# EAGLE design BOTTOM_BRD_v.1.0.3 (EAGLE 9.6.2)
NYU Shanghai Swarm Robotics 2020
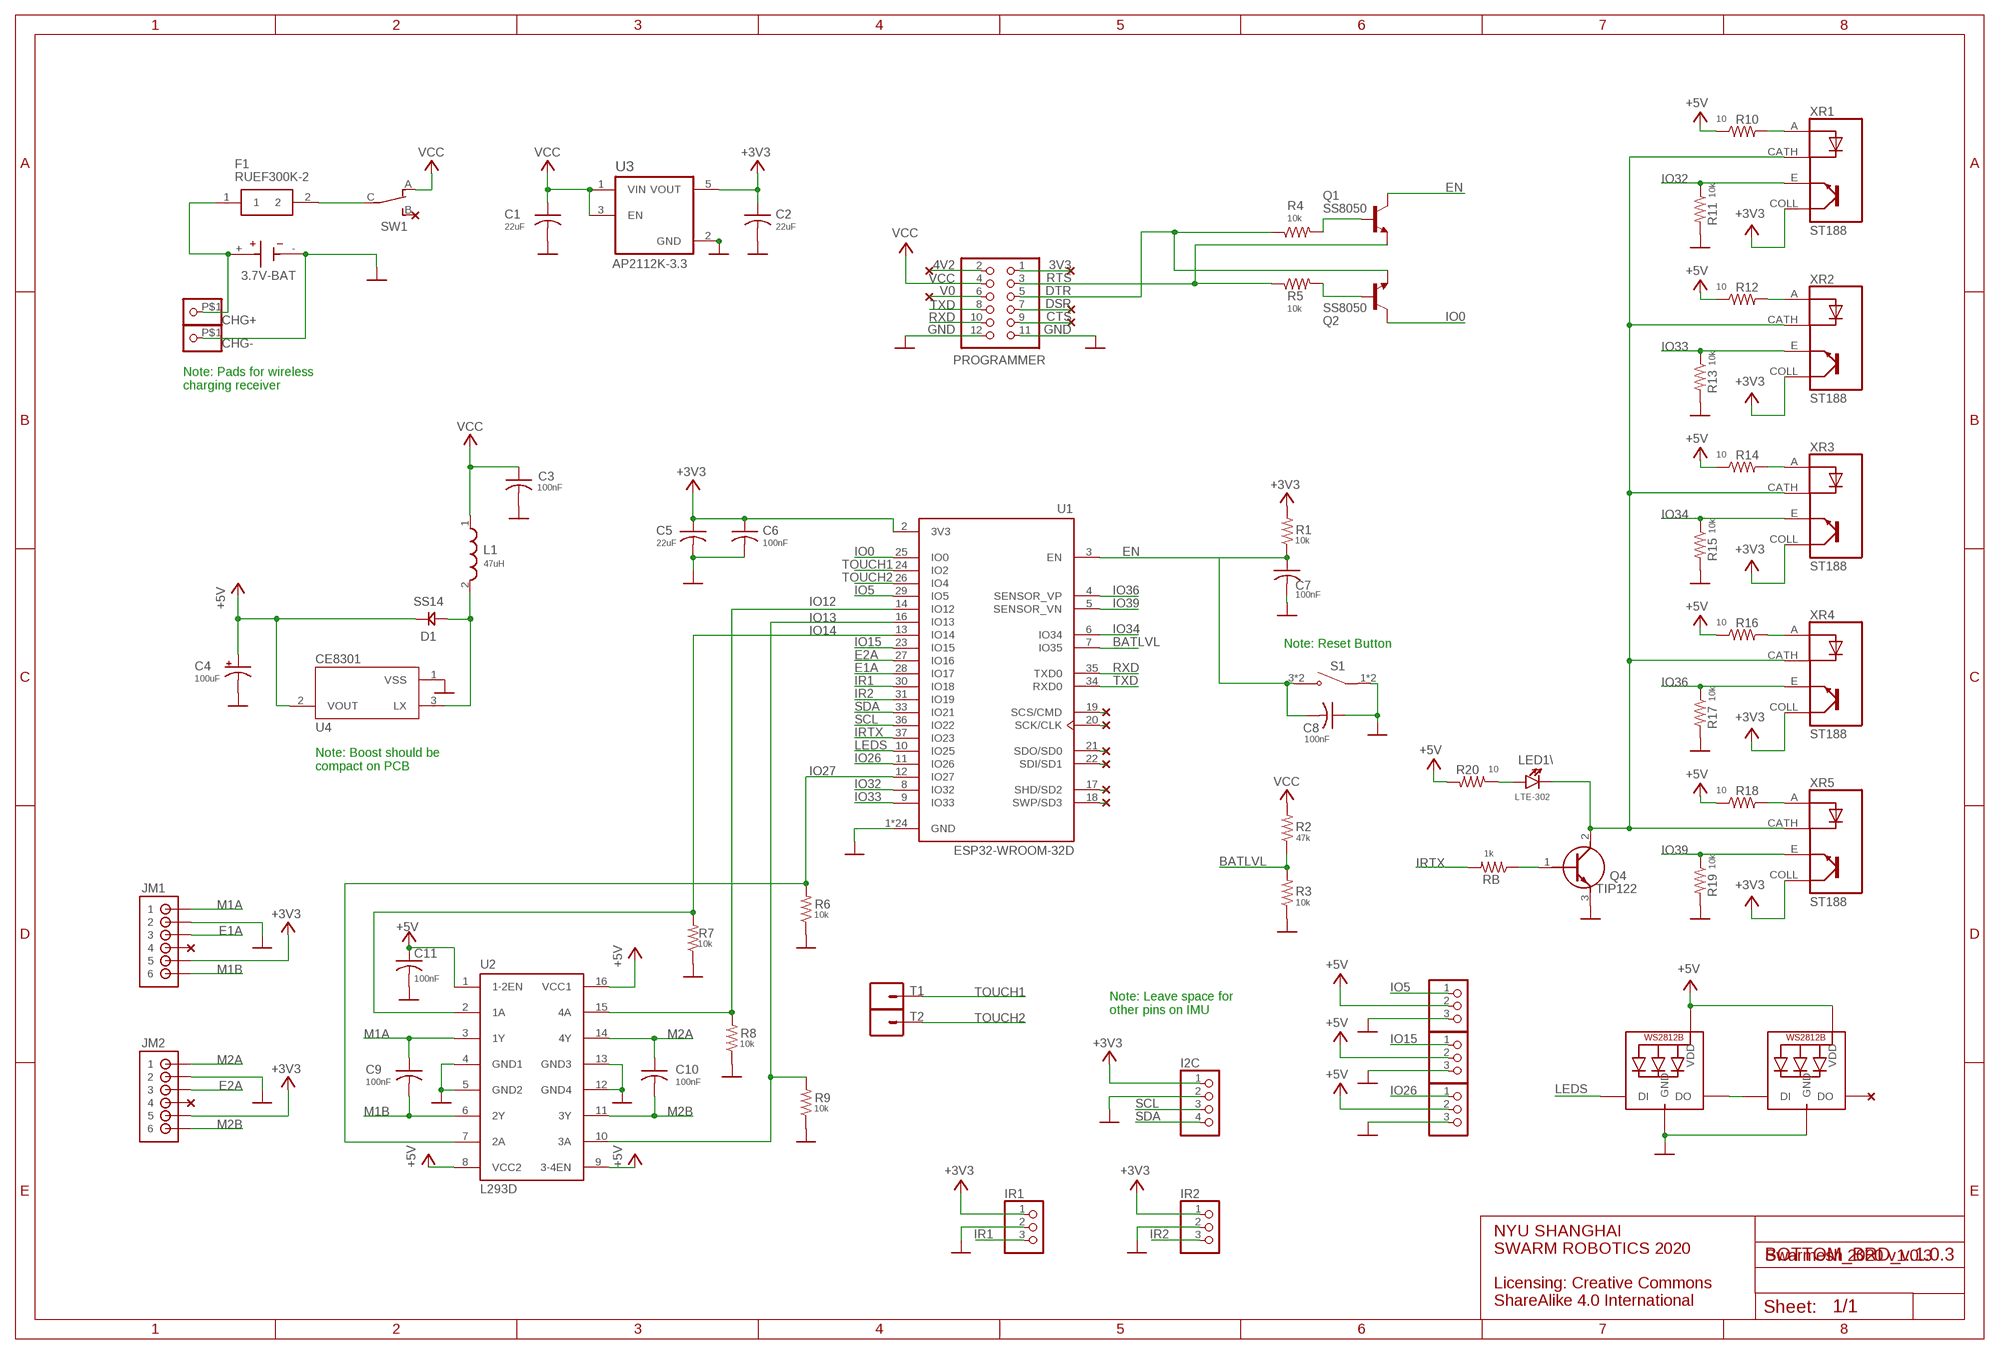
[diagram p0: schematic, sheet 1]

## Parts
BT  3.7V-BAT  6S-AA  [BAT_6S-AA]
C1  22uF  C-USC0805  [C0805]
C2  22uF  C-USC0805  [C0805]
C3  100nF  C-USC0805  [C0805]
C4  100uF  CPOL-US153CLV-0605  [153CLV-0605]
C5  22uF  C-USC0805  [C0805]
C6  100nF  C-USC0805  [C0805]
C7  100nF  C-USC0805  [C0805]
C8  100nF  C-USC0805  [C0805]
C9  100nF  C-USC0805  [C0805]
C10  100nF  C-USC0805  [C0805]
C11  100nF  C-USC0805  [C0805]
CHARGING  WS2812B5050  [WS2812B]
CHG+  PINHD-1X1-BIGPOGO  [1X1-BIGPOGO]
CHG-  PINHD-1X1-BIGPOGO  [1X1-BIGPOGO]
D1  SS14  [DO214]
F1  RUEF300K-2  [RUEF300K2]
GPIO5  PINHD-1X3  [1X03]
GPIO15  PINHD-1X3  [1X03]
GPIO26  PINHD-1X3  [1X03]
I2C  PINHD-1X4  [1X04]
IR1  PINHD-1X3  [1X03]
IR2  PINHD-1X3  [1X03]
JM1  B6B-ZR  [B6B-ZR]
JM2  B6B-ZR  [B6B-ZR]
L1  47uH  SDR0604-100KL  [INDP5858X480N]
LED1\  LTE-302  [LTE-302]
PROGRAMMER  PINHD-2X6  [2X06]
Q1  SS8050  BC850  [SOT23]
Q2  SS8050  BC850  [SOT23]
Q4  TIP122  [TO270P460X1020X2008-3P]
R1  10k  R-US_M0805  [M0805]
R2  47k  R-US_M0805  [M0805]
R3  10k  R-US_M0805  [M0805]
R4  10k  R-US_M0805  [M0805]
R5  10k  R-US_M0805  [M0805]
R6  10k  R-US_M0805  [M0805]
R7  10k  R-US_M0805  [M0805]
R8  10k  R-US_M0805  [M0805]
R9  10k  R-US_M0805  [M0805]
R10  10  R-US_M0805  [M0805]
R11  10k  R-US_M0805  [M0805]
R12  10  R-US_M0805  [M0805]
R13  10k  R-US_M0805  [M0805]
R14  10  R-US_M0805  [M0805]
R15  10k  R-US_M0805  [M0805]
R16  10  R-US_M0805  [M0805]
R17  10k  R-US_M0805  [M0805]
R18  10  R-US_M0805  [M0805]
R19  10k  R-US_M0805  [M0805]
R20  10  R-US_M0805  [M0805]
RB  1k  R-US_M0805  [M0805]
S1  2-1437565-9  [SW_2-1437565-9]
STATE  WS2812B5050  [WS2812B]
SW1  CS12ANW03  [CS12ANW03]
T1  CONN_01SPRING-CONN  [SPRING-CONNECTOR]
T2  CONN_01SPRING-CONN  [SPRING-CONNECTOR]
U1  ESP32-WROOM-32D  [MODULE_ESP32-WROOM-32D]
U2  L293D  [DIL16]
U3  AP2112K-3.3  AP2112K-3.3TRG1  [SOT95P285X140-5N]
U4  CE8301  MCP1702T-3302E/MB  [REG_MCP1702T-3302E/MB]
XR1  ST188  TCRT1000  [XDCR_TCRT1000]
XR2  ST188  TCRT1000  [XDCR_TCRT1000]
XR3  ST188  TCRT1000  [XDCR_TCRT1000]
XR4  ST188  TCRT1000  [XDCR_TCRT1000]
XR5  ST188  TCRT1000  [XDCR_TCRT1000]

## Nets
3V3: PROGRAMMER.1
4V2: PROGRAMMER.2
+3V3: C2.1 C5.1 C6.1 I2C.1 IR1.1 IR2.1 JM1.5 JM2.5 R1.2 U1.2(3V3) U3.5(VOUT) XR1.COLL(CO) XR2.COLL(CO) XR3.COLL(CO) XR4.COLL(CO) XR5.COLL(CO)
+5V: C4.+ C11.1 CHARGING.1-VDD(VDD) D1.CATHODE(KATHODE) GPIO5.2 GPIO15.2 GPIO26.2 R10.1 R12.1 R14.1 R16.1 R18.1 R20.2 STATE.1-VDD(VDD) U2.1(1-2EN) U2.8(VCC2) U2.9(3-4EN) U2.16(VCC1) U4.2(VOUT)
BATLVL: R2.1 R3.2 U1.7(IO35)
CTS: PROGRAMMER.9
DSR: PROGRAMMER.7
DTR: PROGRAMMER.5 Q2.2(E) R4.1
E1A: JM1.3 U1.28(IO17)
E2A: JM2.3 U1.27(IO16)
EN: C7.1 C8.2 Q1.3(C) R1.1 S1.3(NO) S1.4(NO) U1.3(EN)
GND: BT.- C1.2 C2.2 C3.2 C4.- C5.2 C6.2 C7.2 C8.1 C11.2 CHARGING.3-GND(GND) CHG-.P$1 GPIO5.3 GPIO15.3 GPIO26.3 I2C.2 IR1.2 IR2.2 JM1.2 JM2.2 PROGRAMMER.11 PROGRAMMER.12 Q4.3(E) R3.1 R6.1 R7.1 R8.1 R9.1 R11.2 R13.2 R15.2 R17.2 R19.2 S1.1(COM) S1.2(COM) STATE.3-GND(GND) U1.1(GND) U1.15(GND) U1.38(GND) U1.39_1(GND) U1.39_2(GND) U1.39_3(GND) U1.39_4(GND) U1.39_5(GND) U1.39_6(GND) U1.39_7(GND) U1.39_8(GND) U1.39_9(GND) U1.39_10(GND) U1.39_11(GND) U1.39_12(GND) U1.39_13(GND) U1.39_14(GND) U1.39_15(GND) U1.39_16(GND) U1.39_17(GND) U1.39_18(GND) U1.39_19(GND) U1.39_20(GND) U1.39_21(GND) U2.4(GND1) U2.5(GND2) U2.12(GND4) U2.13(GND3) U3.2(GND) U4.1(VSS)
IO0: Q2.3(C) U1.25(IO0)
IO5: GPIO5.1 U1.29(IO5)
IO12: R8.2 U1.14(IO12) U2.15(4A)
IO13: R9.2 U1.16(IO13) U2.10(3A)
IO14: R7.2 U1.13(IO14) U2.2(1A)
IO15: GPIO15.1 U1.23(IO15)
IO26: GPIO26.1 U1.11(IO26)
IO27: R6.2 U1.12(IO27) U2.7(2A)
IO32: R11.1 U1.8(IO32) XR1.E
IO33: R13.1 U1.9(IO33) XR2.E
IO34: R15.1 U1.6(IO34) XR3.E
IO36: R17.1 U1.4(SENSOR_VP) XR4.E
IO39: R19.1 U1.5(SENSOR_VN) XR5.E
IR1: IR1.3 U1.30(IO18)
IR2: IR2.3 U1.31(IO19)
IRTX: RB.2 U1.37(IO23)
LEDS: CHARGING.4-DIN(DI) U1.10(IO25)
M1A: C9.1 JM1.1 U2.3(1Y)
M1B: C9.2 JM1.6 U2.6(2Y)
M2A: C10.1 JM2.1 U2.14(4Y)
M2B: C10.2 JM2.6 U2.11(3Y)
N$1: BT.+ CHG+.P$1 F1.1
N$2: Q4.1(B) RB.1
N$3: F1.2 SW1.C
N$4: D1.ANODE L1.2 U4.3(LX)
N$5: U1.19(SCS/CMD)
N$6: R12.2 XR2.A
N$7: R16.2 XR4.A
N$8: LED1\.C Q4.2(C) XR1.CATH(C) XR2.CATH(C) XR3.CATH(C) XR4.CATH(C) XR5.CATH(C)
N$9: CHARGING.2-DOUT(DO) STATE.4-DIN(DI)
N$10: R14.2 XR3.A
N$11: R18.2 XR5.A
N$12: Q1.1(B) R4.2
N$13: R10.2 XR1.A
N$14: LED1\.A R20.1
N$15: Q2.1(B) R5.2
N$16: U1.20(SCK/CLK)
N$18: U1.21(SDO/SD0)
N$23: U1.22(SDI/SD1)
N$24: U1.17(SHD/SD2)
N$25: U1.18(SWP/SD3)
RTS: PROGRAMMER.3 Q1.2(E) R5.1
RXD: PROGRAMMER.10 U1.35(TXD0)
SCL: I2C.3 U1.36(IO22)
SDA: I2C.4 U1.33(IO21)
TOUCH1: T1.P$2 U1.24(IO2)
TOUCH2: T2.P$2 U1.26(IO4)
TXD: PROGRAMMER.8 U1.34(RXD0)
V0: PROGRAMMER.6
VCC: C1.1 C3.1 L1.1 PROGRAMMER.4 R2.2 SW1.A U3.1(VIN) U3.3(EN)
Unconnected: JM1.4 JM2.4 STATE.2-DOUT(DO) SW1.B

## Notes on the sheet
- Note: Pads for wireless 
  charging receiver
- Note: Reset Button
- Note: Boost should be
  compact on PCB
- Note: Leave space for 
  other pins on IMU
- Swarmesh 2020 v1.0.3
- NYU SHANGHAI
  SWARM ROBOTICS 2020
  
  Licensing: Creative Commons
  ShareAlike 4.0 International

## Library data of the parts
BT = 6S-AA:6S-AA; AVAILABILITY: Unavailable; DESCRIPTION: BATTERY HOLDER AA PC PIN; DIGIKEY-PURCHASE-URL: https://snapeda.com/shop?store=DigiKey&id=4389101; MF: MPD; MP: 6S-AA; PACKAGE: None; PRICE: None
C1-C3 C5-C11 = rcl:C-US: CAPACITOR, American symbol; SPICEPREFIX: C
C4 = rcl:CPOL-US: POLARIZED CAPACITOR, American symbol; SPICEPREFIX: C
CHARGING STATE = adafruit:WS2812B
CHG+ CHG- = adafruit:PINHD-1X1: Pin header 1x1 for 0.1" spacing With round pins
D1 = SS14:SS14; AVAILABILITY: Unavailable; DESCRIPTION: Diode Schottky 40V 1A Surface Mount SMA (DO-214AC); DIGIKEY-PURCHASE-URL: https://snapeda.com/shop?store=DigiKey&id=229686; MF: ON Semiconductor; MP: SS14; PACKAGE: DO-214AC-214 ON Semiconductor; PRICE: None
F1 = RUEF300K-2:RUEF300K-2: TE CONNECTIVITY / RAYCHEM - RUEF300K-2 - RESETTABLE FUSE, PTC, 30V, 3A, RADIAL Source: Datasheet <http://www.farnell.com/datasheets/1482689.pdf>; DESCRIPTION: TE CONNECTIVITY / RAYCHEM - RUEF300K-2 - RESETTABLE FUSE, PTC, 30V, 3A, RADIAL; HEIGHT: 16.5mm; MANUFACTURER_NAME: TE CONNECTIVITY / RAYCHEM; MANUFACTURER_PART_NUMBER: RUEF300K-2
GPIO5 GPIO15 GPIO26 IR1 IR2 = adafruit:PINHD-1X3: PIN HEADER
I2C = pinhead:PINHD-1X4: PIN HEADER
JM1 JM2 = B6B-ZR:B6B-ZR: JST-ZH Connector 6 pol, 1.5mm pitch Package: B6B-ZR Source: http://www.jst-mfg.com/product/pdf/eng/eZH.pdf; AVAILABILITY: Unavailable; DESCRIPTION: Connector Header Surface Mount 6 position 0.059 _1.50mm_; MF: JST; MP: B6B-ZR; PACKAGE: None; PRICE: None
L1 = SDR0604-100KL:SDR0604-100KL: Inductor Power Wirewound 120uH 10% 1KHz 22Q-Factor Ferrite 480mA 930mOhm DCR T/R; AVAILABILITY: Unavailable; DESCRIPTION: 10µH Unshielded Wirewound Inductor Nonstandard; MF: Bourns; MP: SDR0604-100KL; PACKAGE: Nonstandard Bourns; PRICE: None
LED1\ = LTE-302:LTE-302: Through-hole side-firing 940nm IR LED; DESCRIPTION: Infrared (IR) Emitter 940nm 1.2V 50mA 0.662mW/sr @ 20mA 40° Radial, Side View; DIGI-KEY_PART_NUMBER: 160-1930-ND; MF: Lite-On Inc.; MP: LTE-302; PACKAGE: Radial Lite-On
PROGRAMMER = pinhead:PINHD-2X6: PIN HEADER
Q1 Q2 = transistor:BC850: NPN TRANSISTOR
Q4 = TIP122:TIP122: TIP122, Darlington Transistor, NPN 8 A 100 V HFE:1000, 3-Pin, TO-220 Source: Datasheet <https://componentsearchengine.com/Datasheets/1/TIP122.pdf>; DESCRIPTION: TIP122, Darlington Transistor, NPN 8 A 100 V HFE:1000, 3-Pin, TO-220; HEIGHT: 4.6mm; MANUFACTURER_NAME: STMicroelectronics; MANUFACTURER_PART_NUMBER: TIP122; MOUSER_PART_NUMBER: 511-TIP122; MOUSER_PRICE-STOCK: https://www.mouser.com/Search/Refine.aspx?Keyword=511-TIP122
R1-R20 RB = rcl:R-US_: RESISTOR, American symbol; SPICEPREFIX: R
S1 = pushswitch:2-1437565-9; AVAILABILITY: Unavailable; COMMENT: 2-1437565-9; DESCRIPTION: Tactile Switch SPST-NO Top Actuated Surface Mount; MF: TE Connectivity; MP: 2-1437565-9; PACKAGE: SMD-6 Omron Electronics; PRICE: None
SW1 = SWITCH_C:CS12ANW03; AVAILABILITY: Unavailable; DESCRIPTION: Slide Switch SPDT Through Hole; DIGIKEY-PURCHASE-URL: https://snapeda.com/shop?store=DigiKey&id=478299; MF: NKK Switches; MP: CS12ANW03; PACKAGE: None; PRICE: None
T1 T2 = Touch_Pad:CONN_01: Single connection point. Often used as Generic Header-pin footprint for 0.1 inch spaced/style header connections On any of the 0.1 inch spaced packages, you can populate with these: Break Away Headers - Straight <https://www.sparkfun.com/products/116> (PRT-00116) Break Away Male Headers - Right Angle <https://www.sparkfun.com/products/553> (PRT-00553) Female Headers <https://www.sparkfun.com/products/115> (PRT-00115) Break Away Headers - Machine Pin <https://www.sparkfun.com/products/117> (PRT-00117) Break Away Female Headers - Swiss Machine Pin <https://www.sparkfun.com/products/743> (PRT-00743) This device is also useful as a general connection point to wire up your design to another part of your project. Our various solder wires solder well into these plated through hole pads. Hook-Up Wire - Assortment (Stranded, 22 AWG) <https://www.sparkfun.com/products/11375> (PRT-11375) Hook-Up Wire - Assortment (Solid Core, 22 AWG) <https://www.sparkfun.com/products/11367> (PRT-11367) View the entire wire category on our website here <https://www.sparkfun.com/categories/141> Special notes: SMTSO-256-ET is a "flush mount" nut for a 4-40 screw. We mostly use this on specialty testbeds; it is a nice way to connect hardware to your PCB at an adjustable hieght. Also note, the SNAP packages are for using a snappable style connector. We sell a baggie of snaps and they are also used on two LilyPad designs: Snap Assortment - 30 pack (male and female) <https://www.sparkfun.com/products/11347> (DEV-11347) LilyPad Arduino SimpleSnap <https://www.sparkfun.com/products/10941> (DEV-10941) LilyPad SimpleSnap Protoboard <https://www.sparkfun.com/products/10940> (DEV-10940); SF_ID: PRT-11822
U1 = ESP32-WROOM-32D:ESP32-WROOM-32D: Bluetooth, WiFi 802.11b/g/n, Bluetooth v4.2 + EDR, Class 1, 2 and 3 Transceiver Module 2.4GHz ~ 2.5GHz Integrated, Trace Surface Mount; AVAILABILITY: Unavailable; DESCRIPTION: Bluetooth, WiFi 802.11b/g/n, Bluetooth v4.2 +EDR, Class 1, 2 and 3 Transceiver Module 2.4GHz ~ 2.5GHz Integrated, Trace Surface Mount; MF: Espressif Systems; MP: ESP32-WROOM-32D; PACKAGE: Module Espressif Systems; PRICE: None
U2 = st-microelectronics:L293D: PUSH-PULL 4 CHANNEL DRIVER; MPN: L293D; OC_FARNELL: 9589619; OC_NEWARK: 56P8249
U3 = AP2112K-3.3TRG1:AP2112K-3.3TRG1: AP2112 Series 0.6 A 3.3 V Fixed Output SMT LDO Linear Regulator - SOT23-5; AVAILABILITY: Unavailable; DESCRIPTION: Linear Voltage Regulator IC 1 Output 600mA SOT-25; MF: Diodes Inc.; MP: AP2112K-3.3TRG1; PACKAGE: SOT-753 Diodes Inc.; PRICE: None
U4 = MCP1702T-3302E_MB:MCP1702T-3302E/MB: MCP1702 Series 250 mA 3.3 V Fixed Output Surface Mount LDO Regulator - SOT-89; AVAILABILITY: Unavailable; DESCRIPTION: Linear Voltage Regulator IC 1 Output 250mA SOT-89-3; MF: Microchip; MP: MCP1702T-3302E/MB; PACKAGE: SOT-89 Microchip; PRICE: None
XR1-XR5 = ST188:TCRT1000: Optical Sensor The TCRT1000 and TCRT1010 are reflective sensors which include an infrared emitter and phototransistor in a leaded package which blocks visible light; AVAILABILITY: Unavailable; DESCRIPTION: Reflective Optical Sensor 0.157 (4mm) PCB Mount; MF: Vishay; MP: TCRT1000; PACKAGE: PCB Mount Vishay; PRICE: None

## Board
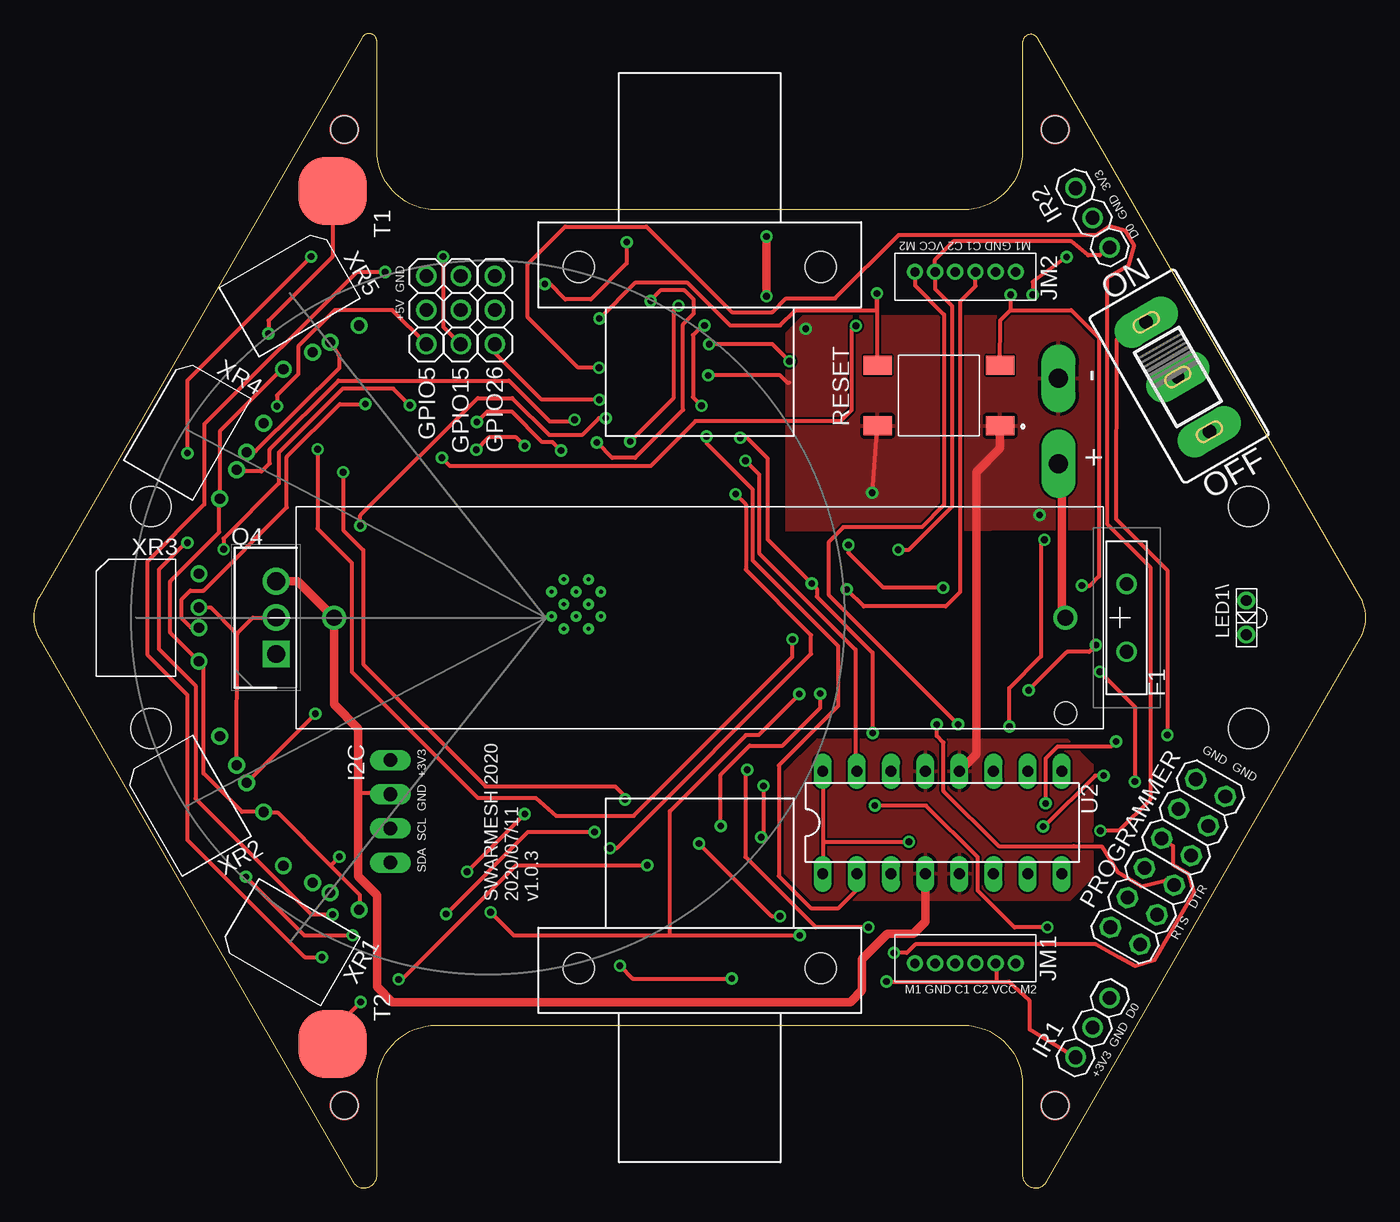
[diagram p1: board, top side]
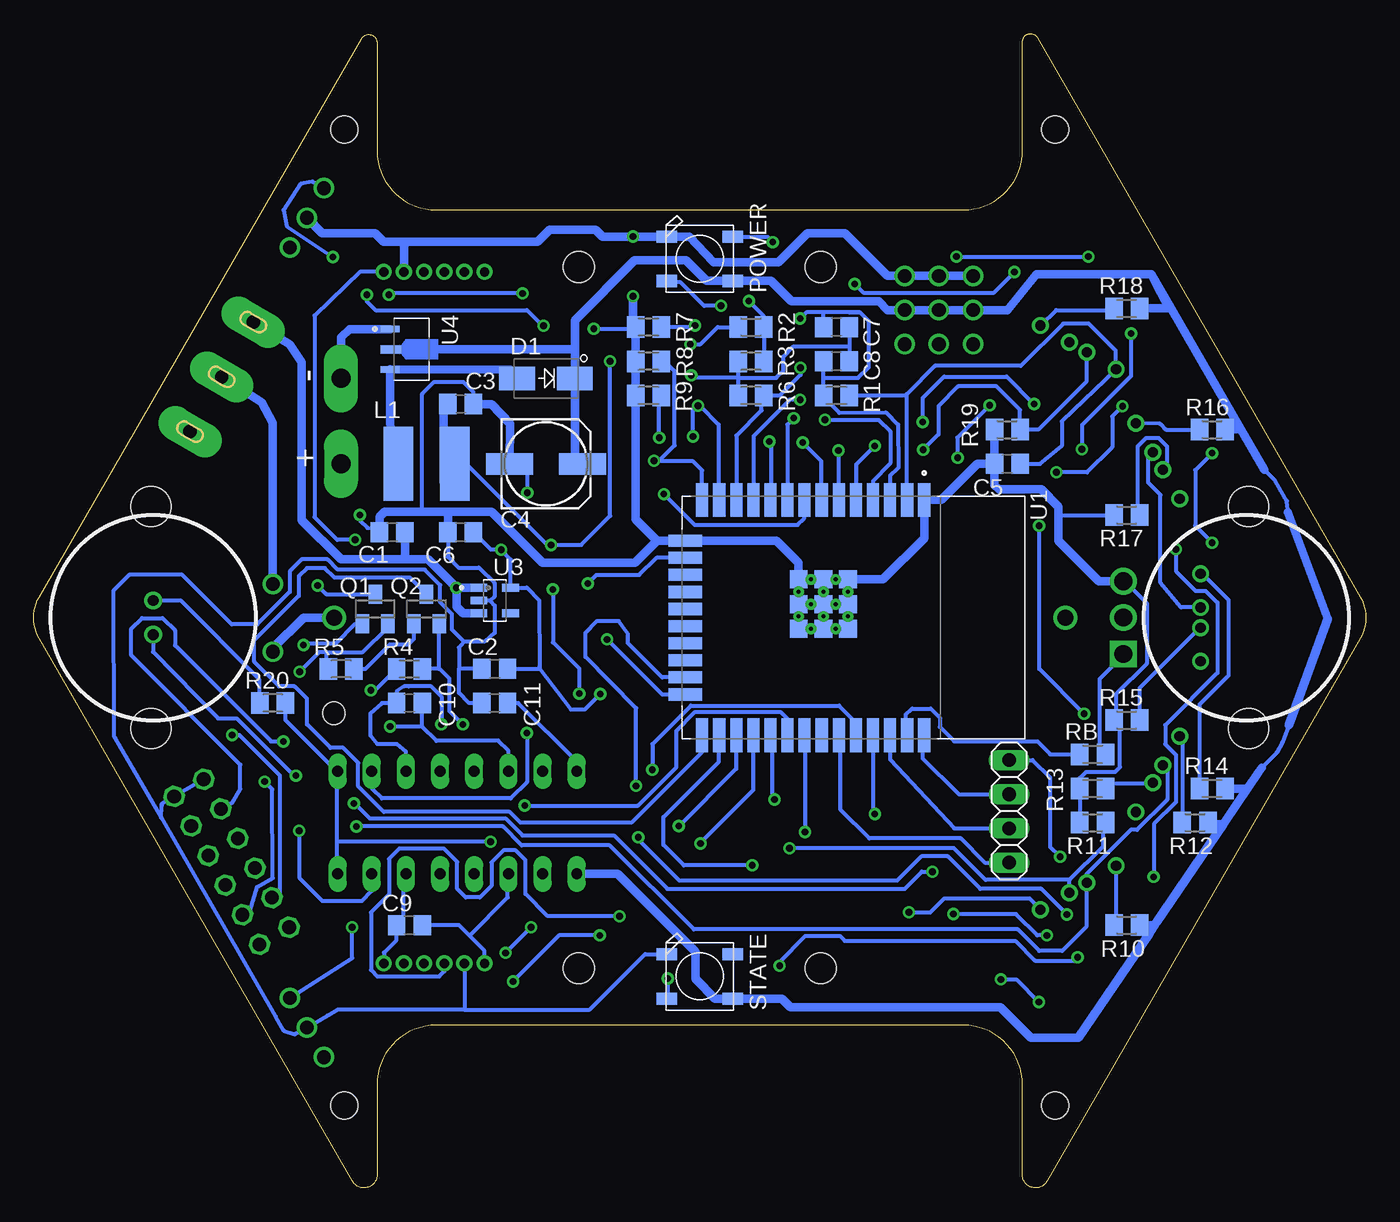
[diagram p2: board, bottom side, seen from below]

Size 99.06 x 85.8 mm. Coordinates in mm from the lower left corner, seen from the top.
Outline: 75.33,0.48 98.65,40.87 arc60 98.65,43.91 74.68,85.43 arc150 73.53,85.12 73.53,77.1 arc-90 69.12,72.69 29.94,72.69 arc-90 25.53,77.1 25.53,85.2 arc150 24.42,85.5 0.41,43.91 arc60 0.41,40.87 23.73,0.48 arc150 25.53,0.97 25.53,7.68 arc-90 29.94,12.09 69.12,12.09 arc-90 73.53,7.68 73.53,0.97 arc150 75.33,0.48
Copper layers (1*16): Top 0.035mm / dielectric 0.15mm / Bottom 0.035mm
Design rules "default *": minimum track width 12mil, minimum drill 0.5mm, track to track 6mil, track to pad 6mil, pad to pad 6mil, via to via 20mil, smd to smd 6mil, copper to edge 40mil, drill to drill 25mil, minimum pad ring 10mil, minimum via ring 8mil, stop-mask expansion 4mil, vias tented up to drill 0mil, thermal gap 10mil
Holes 2 mm at 75.96,78.66 23.11,78.66 23.11,6.12 75.96,6.12
Holes 3 mm at 8.73,50.64 8.73,34.14 90.33,50.64 90.33,34.14
Holes 2.3 mm at 58.53,16.33 40.53,16.33 40.53,68.45 58.53,68.45
tKeepout: area 74.3,77 to 77.6,80.3; area 21.5,77 to 24.7,80.3; area 21.5,4.5 to 24.7,7.7; area 74.3,4.5 to 77.6,7.7
tRestrict: area 30.8,33.4 to 49.8,51.3

### Footprints (pad centres in the part's own frame; a part is rotated, then mirrored left to right if it is on the bottom)
BAT_6S-AA = drill 1.19: + -27.2,0; - 27.2,0 | hole 1.67: -27.2,7.1
C0805 = smd 1.3 x 1.5: 1 -0.95,0; 2 0.95,0
153CLV-0605 = smd 3.5 x 1.6: + 2.7,0; - -2.7,0
WS2812B = smd 1.5 x 0.9: 1-VDD 2.45,-1.65; 2-DOUT 2.45,1.65; 3-GND -2.45,1.65; 4-DIN -2.45,-1.65
1X1-BIGPOGO = drill 1.4 pad 2.54 long: P$1 0,0
DO214 = smd 2.65 x 1.75: ANODE -2.15,0; CATHODE 2.15,0
RUEF300K2 = drill 1.01 pad 1.515: 1 0,0; 2 5.05,0
1X03 = drill 1.016: 1 -2.54,0; 2 0,0; 3 2.54,0
1X04 = drill 1.016 long: 1 -3.81,0; 2 -1.27,0; 3 1.27,0; 4 3.81,0
B6B-ZR = drill 0.7: 1 9,-1.3; 2 7.5,-1.3; 3 6,-1.3; 4 4.5,-1.3; 5 3,-1.3; 6 1.5,-1.3
INDP5858X480N = smd 2.2 x 5.5: 1 -2.1,0; 2 2.1,0
LTE-302 = drill 0.8: A 1.27,0; C -1.27,0
2X06 = drill 1.016 octagon: 1 -6.35,-1.27; 2 -6.35,1.27; 3 -3.81,-1.27; 4 -3.81,1.27; 5 -1.27,-1.27; 6 -1.27,1.27; 7 1.27,-1.27; 8 1.27,1.27; 9 3.81,-1.27; 10 3.81,1.27; 11 6.35,-1.27; 12 6.35,1.27
SOT23 = smd 1 x 1.4: 1 -0.95,-1.1; 2 0.95,-1.1; 3 0,1.1
TO270P460X1020X2008-3P = drill 1.32 pad 1.98 square: 1 0,0 | drill 1.32 pad 1.98: 2 2.7,0; 3 5.4,0
M0805 = smd 1.3 x 1.6: 1 -0.95,0; 2 0.95,0
SW_2-1437565-9 = smd 2.1 x 1.4: 1 -4.55,2.25; 2 4.55,2.25; 3 -4.55,-2.25; 4 4.55,-2.25
CS12ANW03 = drill 1 pad 2.54 long: A -4.674,0; B 4.724,0; C 0.025,0
SPRING-CONNECTOR = smd 5.08 x 5.08: P$2 0,0
MODULE_ESP32-WROOM-32D = smd 2.5 x 0.9: 1 -8.75,5.26; 2 -8.75,3.99; 3 -8.75,2.72; 4 -8.75,1.45; 5 -8.75,0.18; 6 -8.75,-1.09; 7 -8.75,-2.36; 8 -8.75,-3.63; 9 -8.75,-4.9; 10 -8.75,-6.17; 11 -8.75,-7.44; 12 -8.75,-8.71; 13 -8.75,-9.98; 14 -8.75,-11.25; 25 8.75,-11.25; 26 8.75,-9.98; 27 8.75,-8.71; 28 8.75,-7.44; 29 8.75,-6.17; 30 8.75,-4.9; 31 8.75,-3.63; 32 8.75,-2.36; 33 8.75,-1.09; 34 8.75,0.18; 35 8.75,1.45; 36 8.75,2.72; 37 8.75,3.99; 38 8.75,5.26 | smd 0.9 x 2.5: 15 -5.715,-12.5; 16 -4.445,-12.5; 17 -3.175,-12.5; 18 -1.905,-12.5; 19 -0.635,-12.5; 20 0.635,-12.5; 21 1.905,-12.5; 22 3.175,-12.5; 23 4.445,-12.5; 24 5.715,-12.5 | smd 1.33 x 1.33: 39_1 -2.835,-0.405; 39_2 -1,-0.405; 39_3 0.835,-0.405; 39_4 -2.835,-2.24; 39_5 -1,-2.24; 39_6 0.835,-2.24; 39_7 -2.835,-4.075; 39_8 -1,-4.075; 39_9 0.835,-4.075 | drill 0.3 pad 0.4: 39_10 -1.917,-0.405; 39_11 -0.083,-0.405; 39_12 -2.835,-1.323; 39_13 -1,-1.323; 39_14 0.835,-1.323; 39_15 -1.917,-2.24; 39_16 -0.083,-2.24; 39_17 -2.835,-3.158; 39_18 -1,-3.158; 39_19 0.835,-3.158; 39_20 -1.917,-4.075; 39_21 -0.083,-4.075
DIL16 = drill 0.813 long: 1 -8.89,-3.81; 2 -6.35,-3.81; 3 -3.81,-3.81; 4 -1.27,-3.81; 5 1.27,-3.81; 6 3.81,-3.81; 7 6.35,-3.81; 8 8.89,-3.81; 9 8.89,3.81; 10 6.35,3.81; 11 3.81,3.81; 12 1.27,3.81; 13 -1.27,3.81; 14 -3.81,3.81; 15 -6.35,3.81; 16 -8.89,3.81
SOT95P285X140-5N = smd 1.35 x 0.6: 1 -1.185,0.95; 2 -1.185,0; 3 -1.185,-0.95; 4 1.185,-0.95; 5 1.185,0.95
REG_MCP1702T-3302E/MB = smd 1.4 x 0.48: 1 -1.425,1.5; 3 -1.425,-1.5 | smd 1.525 x 0.56: 2 -1.365,0
XDCR_TCRT1000 = drill 0.75 pad 1.1: A -3.25,4.67; CATH -0.75,4.67; COLL 3.25,4.67; E 0.75,4.67

### Placement (x,y rotation side)
BT  49.53,42.39 180 top
C1  72.39,48.74 180 bottom
C2  64.77,38.58 180 bottom
C3  67.31,58.27 0 bottom
C4  60.96,53.82 0 bottom
C5  26.67,53.82 180 bottom
C6  67.31,48.74 180 bottom
C7  39.37,63.98 0 bottom
C8  39.37,61.44 180 bottom
C9  71.12,19.53 180 bottom
C10  71.12,36.04 180 bottom
C11  64.77,36.04 180 bottom
CHARGING  49.53,69.06 0 bottom
CHG+  76.2,53.82 270 bottom
CHG-  76.2,60.17 90 top
D1  60.96,60.17 0 bottom
F1  81.28,39.85 90 top
GPIO5  29.21,65.25 90 top
GPIO15  31.75,65.25 90 top
GPIO26  34.29,65.25 90 top
I2C  26.53,27.99 270 bottom
IR1  78.74,11.91 60 top
IR2  78.74,72.11 120 top
JM1  74.53,15.39 180 top
JM2  64.03,69.39 0 top
L1  69.85,53.82 180 bottom
LED1\  90.17,42.39 90 top
PROGRAMMER  84.34,24.24 60 top
Q1  73.66,43.03 0 bottom
Q2  69.85,43.03 0 bottom
Q4  18.03,39.69 90 top
R1  39.37,58.9 0 bottom
R2  45.72,63.98 180 bottom
R3  45.72,61.44 0 bottom
R4  71.12,38.58 180 bottom
R5  76.2,38.58 0 bottom
R6  45.72,58.9 0 bottom
R7  53.34,63.98 0 bottom
R8  53.34,61.44 0 bottom
R9  53.34,58.9 0 bottom
R10  17.78,19.53 180 bottom
R11  20.32,27.15 180 bottom
R12  12.7,27.15 180 bottom
R13  20.32,29.69 180 bottom
R14  11.43,29.69 180 bottom
R15  17.78,34.77 180 bottom
R16  11.43,56.36 180 bottom
R17  17.78,50.01 180 bottom
R18  17.78,65.38 180 bottom
R19  26.67,56.36 180 bottom
R20  81.28,36.04 0 bottom
RB  20.32,32.23 180 bottom
S1  67.31,58.9 180 top
STATE  49.53,15.72 0 bottom
SW1  85.06,60.3 300 top
T1  22.23,74.09 0 top
T2  22.23,10.69 0 top
U1  38.1,42.39 270 bottom
U2  67.56,27.15 0 top
U3  64.77,43.66 0 bottom
U4  71.12,62.33 0 bottom
XR1  19.05,18.26 330 top
XR2  11.43,28.42 300 top
XR3  7.62,42.39 270 top
XR4  11.43,56.36 240 top
XR5  19.05,66.52 210 top

### Tracks (layer width: path | path; a pad name or v marks a point on that pad's centre or on a via)
+3V3  (via drill 0.5)
  Top 0.305: XR5.COLL 18.41,60.81 13.84,56.23 XR4.COLL 13.81,51.12 13.81,48.74 10.16,45.09 10.16,41.27 XR3.COLL 12.64,38.83 12.64,30.8 15.49,27.95 16.99,27.95 XR2.COLL 17.11,27.91 18.13,27.91 22.08,23.96 | 71.6,15.34 71.6,16.67 JM1.5 | XR1.COLL 24.26,20.74 24.26,21.79 22.08,23.96 | 22.08,23.96 v22.73,24.61 | v63.4,15.34 71.6,15.34 | 47.31,18.77 35.69,18.77 v33.97,20.48 | 47.31,18.77 v56.96,18.77 | v56.93,36.71 53.88,33.66 52.96,33.66 47.31,28.01 47.31,18.77 | IR1.1 74.05,11.78 74.04,13.94 72.52,15.34 71.6,15.34 | IR2.1 80.01,69.88 79.25,69.32 78.41,69.32 77.17,70.36 68.39,70.36 67.03,69 JM2.5 67.03,66.82 68.29,65.56 68.29,50.65 65.09,47.44 v64.29,47.44
  Bottom 0.305: 62.37,44.61 U3.5 63.58,46.7 64.34,47.46 v64.29,47.44 65.06,47.44 C6.1 | 62.37,44.61 | 63.54,38.3 C2.1 61.55,38.58 61.46,38.58 | R1.2 34.23,58.9 34.13,59 | 34.13,51.28 U1.2 34.13,59 | 34.13,59 32.04,61.09 25.65,61.09 22.51,64.24 20.61,64.24 18.61,62.24 18.61,60.88 XR5.COLL 22.61,56.98 22.61,55.15 24.23,53.82 C5.1 | I2C.1 24.78,31.8 23.49,30.52 23.49,25.37 v22.73,24.61 | v63.4,15.34 63.44,15.34 60.01,18.77 v56.96,18.77 | v33.97,20.48 32.38,20.48 31.37,21.5 24.99,21.5 24.2,20.71 XR1.COLL | v56.93,36.71 58.07,35.57 59.11,35.57 61.42,38.58 61.46,38.58 | 62.37,44.61 61.47,43.66 61.46,38.71 61.46,38.58
+5V  (via drill 0.5)
  Top 0.305: 58.74,25.72 58.74,23.34 U2.1 | 58.74,25.72 58.74,30.96 U2.16 | 58.74,25.72 v65.09,25.72
  Bottom 0.305: 5.71,34.39 6.23,33.1 6.63,32.36 7.75,31.24 | 7.56,53.38 6.78,52.61 5.86,51.04 5.81,50.41 | 5.8,50.27 5.81,50.41 | 5.8,50.24 5.81,50.41 | 76.52,30.96 80.33,34.77 R20.2 | 76.52,30.96 76.52,25.72 | 76.52,25.72 76.52,23.34 U2.8 | 76.52,30.96 U2.9 | C11.1 63.02,36.04 58.74,31.76 58.74,30.96 U2.16 | 3.02,42.39 2.97,42.37 2.82,42.32 | R12.1 | 9.05,29.53 8.95,29.47 | R10.1 16.35,19.06 16.12,18.9 | v65.09,25.72 76.52,25.72 | 14.69,65.38 14.6,65.25 14.45,65.34
  Bottom 0.635: U2.1 55.63,23.34 49.85,17.56 49.85,15.53 48.39,14.07 STATE.1-VDD 43.94,14.07 43.43,14.07 42.8,13.44 27.18,13.44 24.89,11.15 21.37,11.15 16.12,18.9 15.73,19.48 15.53,19.77 | 7.75,31.24 7.96,30.93 | 7.96,30.93 8.82,29.66 10.45,29.66 R14.1 | 7.96,30.93 8.81,29.67 | 8.81,29.67 10.53,27.14 | 8.81,29.67 8.95,29.47 10.61,27.03 | 10.61,27.03 15.53,19.77 | 5.8,50.24 2.82,42.32 4.94,36.5 5.71,34.39 | 58.26,53.57 C4.+ 58.79,54.35 D1.CATHODE 58.81,62.33 | 15.94,67.92 24.49,67.92 26.67,65.25 GPIO5.2 GPIO15.2 GPIO26.2 35.56,65.25 36.19,65.89 41.75,65.89 42.72,65.89 44.25,67.41 CHARGING.1-VDD 49.02,67.41 50.54,68.93 54.36,68.93 58.81,64.49 58.81,62.46 58.81,62.33 | 14.65,65.43 15.24,66.52 15.94,67.92 | 15.94,67.92 | U4.2 58.81,62.33 | 7.56,53.38 9.3,56.4 | 9.3,56.4 14.45,65.34 15.94,67.92 | R16.1 9.3,56.4 | 14.69,65.38 R18.1 | R10.1 15.76,19.53 15.53,19.77 | R12.1 11.63,27.03 10.61,27.03
BATLVL  (via drill 0.5)
  Top 0.305: v45.88,65.92 45.88,65.98 46.61,66.71 48.39,66.71 49.08,66.01 49.08,65 48.29,64.2 48.29,57.82 44.74,54.27 43.02,54.27 v41.88,55.41
  Bottom 0.305: R3.2 R2.1 44.8,63.98 44.8,64.84 v45.88,65.92 | v41.88,55.41 40.48,54.01 40.48,51.28 U1.7
DTR  (via drill 0.5)
  Top 0.305: v67.15,34.45 67.15,33.6 67.66,33.09 67.66,29.5 71.75,25.41 77.34,25.41 79.42,25.39 80.62,23.46 82.35,22.42 84.22,22.87 PROGRAMMER.5
  Bottom 0.305: Q2.2 68.93,41.92 68.93,38.58 R4.1 68.87,38.58 68.13,37.85 68.13,35.44 v67.15,34.45
E1A  (via drill 0.5)
  Top 0.305: v49.47,25.6 54.86,20.2 v55.5,20.2
  Bottom 0.305: JM1.3 68.53,16.09 68.9,15.72 73.5,15.72 73.98,16.2 73.98,20.48 72.64,21.82 72.64,24.45 71.88,25.21 68.55,25.21 67.56,24.23 67.56,22.23 66.93,21.6 65.88,21.6 65.02,22.45 65.02,24.2 64.13,25.09 63.21,25.09 62.48,24.36 62.48,21.85 60.83,20.2 v55.5,20.2 | v49.47,25.6 49.47,25.66 45.56,29.56 45.56,33.5 U1.28
E2A  (via drill 0.5)
  Top 0.305: v60.45,44.49 61.72,43.22 67.82,43.22 68.9,44.3 68.9,65.89 70.03,67.02 JM2.3 | v58.48,36.74 58.48,35.66 55.69,32.87 53.24,32.87 51.09,30.71 v51.09,26.9
  Bottom 0.305: v60.45,44.49 60.45,40.55 58.48,38.58 v58.48,36.74 | v51.09,26.9 46.83,31.15 46.83,33.5 U1.27
EN  (via drill 0.5)
  Top 0.305: 72.64,65.25 77.15,65.25 79.22,63.19 79.22,45.46 78.53,44.77 v77.95,44.77 | 71.75,61.28 S1.3 71.88,64.49 72.64,65.25 | v42.07,64.62 44.77,67.32 48.58,67.32 51.78,64.11 55.5,64.11 56.64,65.25 62.71,65.25 v62.71,66.49 62.71,61.21 S1.4 | v72.64,66.39 72.64,65.25
  Bottom 0.305: 73.66,44.46 Q1.3 77.3,44.13 v77.95,44.77 | R1.1 40.32,58.77 39.15,57.6 35.7,57.64 34.79,56.73 34.75,53.54 35.38,52.92 U1.3 | R1.1 40.32,60.2 | 40.32,60.2 C8.2 | 40.57,64.24 C7.1 40.32,65.02 40.26,65.08 | 38.48,65.09 37.61,65.08 | 40.32,60.2 37.75,60.2 36.96,61 36.96,64.43 37.61,65.08 | R1.1 | v72.64,66.39 72.52,66.52 63.05,66.52 63.09,66.49 v62.71,66.49 | 37.61,65.08 40.26,65.08 | 40.26,65.08 41.6,65.08 v42.07,64.62
GND  (via drill 0.5)
  Top 0.305: v50.16,60.39 55.5,60.39 56.04,59.85 56.17,59.85 | 24.13,29.37 26.51,29.37 I2C.2 | v62.36,51.66 S1.2 | U2.5 68.73,24.1 68.76,24.1
  Top 0.635: Q4.3 19.63,45.09 BT.- 22.33,35.94 24.13,34.14 24.13,29.37 24.13,23.16 25.54,21.75 25.54,14.94 26.67,13.82 60.72,13.82 61.59,14.69 61.59,16.99 63.5,18.9 65.4,18.9 66.29,19.79 U2.4 | U2.12 70.1,32.23 70.1,53.21 71.86,54.96 S1.1 | v54.48,66.27 v54.48,70.71
  Bottom 0.305: PROGRAMMER.12 88.45,29.19 | 88.45,29.19 PROGRAMMER.11 | 67.06,13.26 57.71,13.26 53.59,17.37 STATE.3-GND | JM1.2 67.03,13.28 67.06,13.26 | 67.06,13.26 76.45,13.26 77.22,12.8 IR1.2 79.63,11.41 80.46,11.69 81.05,12.73 | 81.05,12.73 89.58,27.53 | 89.58,27.53 89.53,28.42 89.53,28.55 88.45,29.19 | 81.05,12.73 | 65.85,38.45 C2.2 67.44,38.58 | C11.2 66.67,36.04 67.44,36.8 67.44,38.58 | U3.2 65.15,43.66 65.12,43.63 | 65.12,43.63 64.77,43.28 64.77,41.25 65.53,40.61 67.06,40.61 | 67.44,38.58 67.44,40.16 67.06,40.61 | U1.39_5 40.48,43.5 41.12,43.5 U1.39_18 41.27,43.34 42.07,43.34 U1.39_8 | U1.39_8 42.23,43.5 42.23,44.3 U1.39_20 42.23,44.46 42.23,44.93 U1.39_7 41.91,45.25 41.27,45.25 U1.39_17 41.12,45.25 40.48,45.25 U1.39_4 40.32,45.09 40.32,44.46 U1.39_15 | U1.39_8 42.07,43.19 42.07,42.55 U1.39_21 42.23,42.39 42.23,41.6 U1.39_9 42.07,41.6 41.27,41.6 U1.39_19 41.12,41.6 40.48,41.6 U1.39_6 | 68.32,48.68 C6.2 68.26,46.9 67.47,46.11 65.94,46.11 64.8,44.96 64.8,43.95 65.12,43.63 | 54.48,64.62 54.29,64.46 54.29,64.14 R7.1 54.61,63.98 54.61,63.85 | U1.38 32.96,33.52 32.96,31.95 30.26,29.25 26.54,29.25 I2C.2 | 38.42,62.55 C7.2 | 38.42,62.55 C8.1 | 46.67,60.2 R3.1 | 46.67,60.2 R6.1 | 38.42,62.55 42.54,62.55 43.31,61.79 43.31,60.74 43.85,60.2 46.67,60.2 | 18.45,34.74 18.29,34.58 18.29,31.28 18.64,30.93 20.8,30.93 21.27,30.45 R13.2 | 18.45,34.74 18.57,34.87 18.57,36.68 16.29,38.96 16.29,43.44 17.78,44.93 Q4.3 | R13.2 R11.2 | R13.2 | 38.58,41.6 38.58,42.39 U1.39_11 38.58,42.55 38.58,43.34 | 38.58,41.6 39.37,41.6 U1.39_14 39.53,41.6 40.32,41.6 U1.39_6 | 38.58,41.6 U1.39_3 | U1.39_16 40.48,42.39 40.48,41.76 U1.39_6
  Bottom 0.305: 38.58,43.34 39.37,43.34 U1.39_13 | U1.39_12 39.37,45.25 38.73,45.25 U1.39_1 38.58,44.93 38.58,44.46 U1.39_10 38.58,44.3 38.58,43.5 U1.39_2 38.58,43.34 | 22.86,50.01 R17.2 | 18.57,34.77 R15.2 18.41,34.77 18.45,34.74 | v50.16,60.39 49.97,60.2 46.67,60.2 | C3.2 66.36,59.16 67.12,59.92 69.28,59.92 70.17,59.03 70.17,50.27 | v62.36,51.66 62.36,53.69 C4.- | v57.4,63.85 54.61,63.85 | 54.61,63.85 54.36,63.85 | R8.1 54.33,61.59 54.29,61.59 | GPIO15.3 31.7,67.77 31.7,67.79 | C1.2 73.63,49.04 74.23,49.06 74.8,49.63 v74.8,50.01 | 67.06,40.61 67.94,41.5 67.94,42.65 68.83,43.53 68.83,44.8 69.98,45.95 76.45,45.95 77.22,46.71 79.12,46.71 80.01,45.82 80.01,44.3 82.42,41.88 84.33,41.88 88.01,45.57 91.95,45.57 93.09,44.42 93.07,33.58 92.99,33.43 89.58,27.53 | 67.94,49.12 67.94,48.96
  Bottom 0.635: C5.2 28.89,53.82 31.57,51.14 U1.1 32.84,48.29 35.9,45.23 U1.39_1 | Q4.3 19.84,45.09 22.86,48.11 22.86,50.01 22.86,50.65 24.13,51.92 27.3,51.92 27.62,52.23 C5.2 | IR2.2 77.6,70.97 73.66,70.97 73.02,70.33 71.3,70.33 | JM2.2 71.53,70.11 71.3,70.33 | 71.3,70.33 61.59,70.33 60.71,71.22 57.28,71.22 56.77,70.71 v54.48,70.71 CHARGING.3-GND | CHARGING.3-GND 52.07,70.62 | 54.61,61.44 R8.1 | 52.7,48.11 U1.15 43.81,48.11 42.17,46.47 U1.39_7 | 52.7,48.11 54.29,49.69 R9.1 R8.1 | 52.7,48.11 52.7,48.1 54.35,46.46 61.21,46.46 65.02,50.27 68.26,50.27 | C5.2 R19.2 | GPIO5.3 31.7,67.79 GPIO15.3 GPIO26.3 35.56,67.79 38.74,70.97 41.53,70.97 43.69,68.81 48.51,68.81 50.29,70.71 CHARGING.3-GND | 67.94,49.12 68.26,49.12 | 68.26,50.27 70.17,50.27 72.96,50.27 73.34,49.88 C1.2 | R8.1 54.29,61.59 R7.1 | v54.48,66.27 54.48,64.62 | C3.2 65.01,58.27 63.63,56.78 C4.- | U4.1 75.58,63.83 76.2,63.25 CHG-.P$1 | C6.2 68.26,49.12 | 68.26,49.12 68.26,50.27
  pour Top: 57.26,64.74 76.96,64.74 78.74,62.97 78.74,48.99 56.04,48.87 56.04,63.52
  pour Top: 76.86,33.35 78.74,31.47 78.74,23.09 77.03,21.38 57.84,21.38 55.88,23.34 55.88,30.96 58.27,33.35
IO0
  Bottom 0.305: Q2.3 71.1,45.38 76.71,45.38 77.41,46.07 78.74,46.07 79.34,45.47 79.34,44.01 82.64,40.71 82.64,39.12 80.8,37.28 79.66,37.28 78.74,36.36 78.74,34.45 76.99,32.71 76.04,32.71 74.93,31.6 74.93,29.85 73.02,27.95 63.66,27.95 62.86,27.15 54.61,27.15 49.37,32.39 49.37,33.5 U1.25
IO5  (via drill 0.5)
  Top 0.305: v43.97,28.87 43.97,29.12 43.24,29.85 33.59,29.85 24.51,38.93 24.51,47.41 23.02,48.9 v23.02,53.19 | v18.1,58.11 18.1,58.9 19.68,60.49 19.68,62.55 22.38,65.25 26.67,65.25 GPIO5.1
  Bottom 0.305: v43.97,28.87 44.13,29.02 44.13,33.5 U1.29 | v18.1,58.11 18.86,57.35 18.86,55.06 20.73,53.19 v23.02,53.19
IO12  (via drill 0.5)
  Top 0.305: v52.93,54.04 53.94,53.03 53.94,47.19 61.12,40.01 61.12,30.96 U2.15
  Bottom 0.305: R8.2 52.13,61.44 51.4,60.71 51.4,55.19 52.55,54.04 v52.93,54.04 50.07,54.04 49.35,53.32 U1.14
IO13  (via drill 0.5)
  Top 0.305: v52.55,55.76 53.05,55.76 54.58,54.23 54.58,48.2 v57.85,44.93 58.23,44.55 58.23,43.95 62.39,39.79 v62.39,33.82
  Bottom 0.305: v52.55,55.76 52.55,58.9 R9.2 | U1.16 52.76,46.84 54.03,45.57 57.21,45.57 v57.85,44.93 | U2.10 73.91,29.72 73.15,28.96 63.59,28.96 62.39,30.17 v62.39,33.82
IO14  (via drill 0.5)
  Top 0.305: v49.88,64.11 49.75,64.11 49.02,63.38 49.02,58.77 v49.66,58.14 | U2.2 61.21,22.17 59.85,20.8 57.78,20.8 55.4,23.18 55.4,31.41 59.82,35.82 59.82,40.3 53.47,46.65 53.47,51.92 50.04,55.35 v50.04,55.85
  Bottom 0.305: R7.2 49.88,63.98 v49.88,64.11 | U1.13 48.08,51.17 48.13,51.22 48.13,56.74 49.53,58.14 v49.66,58.14 50.04,57.76 v50.04,55.85
IO15  (via drill 0.5)
  Top 0.305: v54.26,29.88 54.26,26.23 v54.1,26.07 | v22.22,20.33 20.64,20.33 12.03,28.93 12.03,37.34 9.3,40.07 9.3,45.95 11.3,47.95 v11.43,47.95 | v11.43,54.62 11.43,60.01 v20.64,69.22 | v30.45,69.22 30.45,64.01 GPIO15.1
  Bottom 0.305: v54.26,29.88 54.26,35.66 58.04,39.46 58.04,41.25 57.15,42.14 55.57,42.14 54.87,41.18 54.87,40.49 52.32,37.95 U1.23 | v54.1,26.07 54.1,25.91 51.02,22.83 34.86,22.83 33.05,24.64 31.08,24.64 28.67,22.23 24.13,22.23 v22.22,20.33 | v11.43,47.95 12.7,49.22 12.7,53.35 v11.43,54.62 | v30.45,69.22 v20.64,69.22
IO26  (via drill 0.5)
  Top 0.305: GPIO26.1 34.29,62.07 37.52,58.83 37.77,58.58 v42.07,58.58
  Bottom 0.305: U1.11 45.53,55.89 42.83,58.58 v42.07,58.58
IO27  (via drill 0.5)
  Top 0.305: v79.31,26.55 80.71,26.55 83.03,28.87 83.03,46.14 79.85,49.31 79.85,67.66 81.43,68.58 81.84,70.02 81.16,71.13 79.99,71.46 79.06,70.84 64.33,70.84 59.59,66.11 55.94,66.11 54.93,65.09 51.91,65.09 45.56,71.44 39.53,71.44 36.73,68.65 36.73,64.71 40.48,60.97 v42.04,60.97
  Bottom 0.305: 44.93,58.58 44.93,57.79 46.8,55.92 46.8,51.15 U1.12 | 44.93,58.58 44.93,58.9 R6.2 | U2.7 73.91,22.07 74.64,21.34 77.6,21.34 79.31,23.06 v79.31,26.55 | 44.93,58.58 R6.2 | R6.2 43.56,58.9 42.04,60.43 v42.04,60.97
IO32  (via drill 0.5)
  Top 0.305: v52.2,51.57 52.96,50.81 52.96,45.95 57.82,41.09 57.82,39.69 43.37,25.25 v42.86,25.25
  Bottom 0.305: 22.03,22.9 19.53,25.41 19.53,27.15 R11.1 | 22.03,22.06 22.03,22.9 | 22.03,22.06 XR1.E | 22.03,22.06 | v52.2,51.57 49.91,49.28 42.26,49.28 41.75,49.79 41.75,51.12 U1.8 | v42.86,25.25 30.64,25.25 28.29,22.9 22.03,22.9
IO33  (via drill 0.5)
  Top 0.305: v42.54,57.22 42.04,57.22 40.77,55.95 38.35,55.95 35.59,58.71 33.02,58.71 24.29,49.98 v24.29,49.22 | v20.95,35.25 15.87,30.17 XR2.E
  Bottom 0.305: R13.1 18.99,30.07 15.86,30.07 XR2.E | v42.54,57.22 43.02,56.74 43.02,51.28 U1.9 | v24.29,49.22 24.29,38.58 v20.95,35.25
IO34  (via drill 0.5)
  Top 0.305: v39.21,54.81 38.58,55.44 37.81,55.44 35.56,57.69 33.72,57.69 v32.96,56.93 | v24.67,58.27 22.76,58.27 18.83,54.33 18.83,50.58 12.64,44.39 11.65,44.39 11.02,43.76 11.02,42.33 11.7,41.64 XR3.E
  Bottom 0.305: R15.1 16.83,37.15 12.38,41.6 XR3.E | v39.21,54.81 39.21,51.28 U1.6 | v32.96,56.93 32.96,58.71 31.37,60.3 26.7,60.3 v24.67,58.27
IO36  (via drill 0.5)
  Top 0.305: v40.23,57.09 40.1,56.96 38.39,56.96 35.34,60.01 22.67,60.01 17.56,54.9 17.56,53.85 16.95,53.25 15.23,53.25 XR4.E
  Bottom 0.305: R17.1 16.99,50.01 16.99,55.09 16.35,55.73 15.4,55.73 14.76,55.09 14.76,53.82 15.08,53.5 XR4.E | v40.23,57.09 36.23,57.09 35.37,56.23 35.37,53.85 36.65,52.54 U1.4
IO39  (via drill 0.5)
  Top 0.305: v36.51,55.16 35.88,55.79 33.85,55.79 v32.92,54.87
  Bottom 0.305: XR5.E 20.8,62.08 20.8,59.92 24.35,56.36 R19.1 25.72,57.82 27.46,59.57 30.32,59.57 31.78,58.11 31.78,56.01 v32.92,54.87 | v36.51,55.16 37.91,53.76 U1.5
IR1  (via drill 0.5)
  Top 0.305: v62.55,28.42 66.36,28.42 70.2,24.58 70.2,22.1 72.93,19.37 v75.37,19.37
  Bottom 0.305: v62.55,28.42 54.13,28.42 51.28,31.28 51.28,33.98 49.88,35.37 43.53,35.37 43.02,34.87 43.02,33.66 U1.30 | IR1.3 75.37,17.08 v75.37,19.37
IR2  (via drill 0.5)
  Top 0.305: v41.71,26.46 36.77,26.46 v30.67,20.36 | v23.72,18.77 20.13,18.77 v15.78,23.12 | v14.13,47.47 14.13,48.27 18.22,52.36 18.22,54.65 22.99,59.41 26.73,59.41 v27.97,58.17 | v30.35,54.27 v30.35,54.26 30.96,53.66 45.87,53.66 49.21,57 60.01,57 60.83,57.82 60.83,63.75 v61.15,64.08 | v74.28,66.39 74.29,67.35 v76.8,69.19
  Bottom 0.305: v41.71,26.46 v41.72,26.47 U1.31 | v30.67,20.36 26.02,20.36 24.43,18.77 v23.72,18.77 | v14.13,47.47 14.13,45.84 12.67,44.39 11.92,44.39 11.04,43.5 11.04,38.28 14.92,34.4 14.92,32.98 14.13,32.19 14.13,28.68 15.75,27.06 15.75,23.15 v15.78,23.12 | v30.35,54.27 30.38,54.23 30.38,55.76 v27.97,58.17 | v61.15,64.08 61.2,64.08 62.38,65.25 73.65,65.25 74.28,65.89 v74.28,66.39 | 77.47,74.3 IR2.3 78.33,74.8 79.2,74.62 80.48,72.67 80.23,71.49 v76.8,69.19
IRTX
  Bottom 0.305: RB.2 23.46,32.23 24.42,33.18 30.61,33.18 31.69,34.26 31.69,34.96 32.35,35.63 33.75,35.63 34.23,35.15 34.23,33.76 U1.37
LEDS  (via drill 0.5)
  Top 0.305: v47.94,65.57 47.56,65.19 47.56,58.68 v44.35,55.47
  Bottom 0.305: v47.94,65.57 49.21,65.57 50.96,67.32 51.91,67.32 CHARGING.4-DIN | v44.35,55.47 44.23,55.35 44.23,51.38 44.13,51.28 U1.10
M1A
  Bottom 0.305: C9.1 67.44,19.53 66.66,18.75 | 66.66,18.75 63.82,21.6 63.82,23.34 U2.3 | JM1.1 65.53,17.62 66.66,18.75
M1B
  Bottom 0.305: JM1.6 73,17.49 72.07,18.42 C9.2 71.91,19.53 71.56,19.88 71.56,23.34 U2.6
M2A  (via drill 0.5)
  Top 0.305: v75.15,48.17 74.9,47.92 74.9,39.5 72.55,37.15 v72.55,34.3
  Bottom 0.305: 70.17,34.3 C10.1 | 70.17,34.3 69.1,33.23 65.4,33.25 65.4,33.24 64.52,33.25 63.75,32.49 U2.14 | v75.15,48.17 76.49,48.17 78.17,49.85 78.17,64.83 74.8,68.09 JM2.1 | 70.17,34.3 v72.55,34.3
M2B  (via drill 0.5)
  Top 0.305: JM2.6 65.53,67.08 67.69,64.91 67.69,50.78 66.05,49.12 60.21,49.11 59.14,48.04 59.14,44.05 v68.74,34.45
  Bottom 0.305: v68.74,34.45 68.74,36.52 69.5,37.28 71.17,37.28 71.53,37.29 72.06,36.91 C10.2 73.15,36.04 74.02,35.28 74.02,33.63 73.49,32.99 72.04,32.99 71.37,32.42 U2.11
N$1
  Top 0.635: BT.+ 76.45,42.67 76.45,53.57 CHG+.P$1
  Bottom 0.635: BT.+ 78.99,42.39 81.28,40.11 F1.1
N$2
  Bottom 0.305: RB.1 19.81,32.23 19.81,37.82 18.1,39.53 Q4.1
N$3
  Bottom 0.635: F1.2 81.28,56.87 82.12,58.4 SW1.C
N$4
  Bottom 0.305: L1.2 71.95,52.99 72.39,52.55 72.52,52.55 72.64,52.55
  Bottom 0.635: 72.61,54.48 L1.2 | D1.ANODE 63.63,60.81 U4.3 72.52,52.55 | 72.64,52.55 72.64,52.93
N$6
  Bottom 0.305: R12.2 13.65,33.34 13.81,33.5 XR2.A
N$7
  Bottom 0.305: R16.2 14.86,56.36 15.28,56.79 XR4.A
N$8  (via drill 0.5)
  Top 0.305: XR4.CATH 15.87,54.77 16.51,54.77 22.73,60.93 22.73,61.82 22.67,61.91 XR5.CATH | 15.1,41.2 16.29,42.39 Q4.2 | 15.1,41.2 15.14,41.15 XR2.CATH | 15.1,41.2 13.16,43.14 XR3.CATH | v79.56,30.64 78.93,30.64 75.15,26.87 v75.06,26.87
  Bottom 0.305: XR2.CATH 15.08,31.41 14.76,31.09 14.76,28.87 17.02,26.61 17.49,26.61 20.76,23.34 20.76,22.71 XR1.CATH 20.8,22.55 20.8,19.4 22.57,17.63 24.29,17.63 25.88,19.21 49.97,19.21 56.23,25.47 62.77,25.47 64.17,26.87 v75.06,26.87 | v79.56,30.64 79.69,30.64 83.95,34.9 85.35,34.9 90.17,39.85 LED1\.C | XR4.CATH 16.19,54.33 16.19,52.42 15.27,51.5 15.27,44.98 13.76,43.15 XR3.CATH
N$9  (via drill 0.5)
  Top 0.305: v43.59,16.52 44.54,15.56 v51.91,15.56 | v21.43,17.15 20.16,17.15 11.43,25.88 11.43,36.64 8.45,39.63 8.45,46.55 12.7,50.81 12.7,56.77 24,68.08 v26.13,68.08 | v38,67.19 38.39,67.19 39.53,66.05 41.43,66.05 44.1,68.71 v44.1,70.3
  Bottom 0.305: v51.91,15.56 51.91,14.13 STATE.4-DIN | v43.59,16.52 43.59,16.77 41.68,18.74 39.12,18.74 38.73,18.36 26.07,18.36 24.61,16.9 21.68,16.9 v21.43,17.15 | v38,67.19 37.37,66.55 27.65,66.55 v26.13,68.08 | v44.1,70.3 44.48,70.68 47.04,70.68 CHARGING.2-DOUT
N$10
  Bottom 0.305: XR3.A 12.16,45.64 10.22,43.7 10.22,38.07 12.38,35.91 R14.2
N$11
  Bottom 0.305: R18.2 18.73,65.25 23.02,65.25 24.13,64.14 XR5.A
N$12  (via drill 0.5)
  Top 0.305: v78.99,40.36 78.49,39.85 76.83,39.85 v73.98,36.99
  Bottom 0.305: v78.99,40.36 78.87,40.49 76.58,40.49 75.15,41.92 Q1.1 | v73.98,36.99 73.66,36.99 R4.2
N$13
  Bottom 0.305: R10.2 18.57,19.53 18.57,23.82 XR1.A
N$14
  Bottom 0.305: R20.1 82.3,36.04 82.3,37.82 88.14,43.66 LED1\.A
N$15
  Bottom 0.305: R5.2 74.39,38.58 72.57,40.4 71.18,40.4 70.8,40.78 Q2.1
RTS  (via drill 0.5)
  Top 0.305: v81.88,30.2 81.88,35.76 v79.28,38.36
  Bottom 0.305: Q1.2 72.71,41.69 74.58,39.82 77.28,39.82 | v81.88,30.2 81.31,29.63 81.28,23.03 82.45,22.37 82.95,20.6 PROGRAMMER.3 | v79.28,38.36 77.82,39.82 77.28,39.82 | 77.28,39.82 77.28,38.71 R5.1
RXD  (via drill 0.5)
  Top 0.305: v32.23,23.5 v36.51,27.79 | v75.25,28.58 75.25,31.91 76.14,32.8 80.1,32.8 v80.49,33.18
  Bottom 0.305: v36.51,27.79 36.64,27.91 U1.35 | v32.23,23.5 33.02,23.5 34.29,22.23 51.94,22.23 55.91,26.2 62.71,26.2 63.98,27.47 74.07,27.47 75.18,28.58 v75.25,28.58 | v80.49,33.18 81.41,33.18 88.55,40.33 88.55,41.44 89.47,42.36 90.99,42.36 91.79,41.57 91.79,39.6 83.69,31.47 83.69,29.65 84.31,28.62 PROGRAMMER.10
SCL
  Bottom 0.305: I2C.3 30.61,26.72 35.38,31.85 U1.36
SDA
  Bottom 0.305: U1.33 39.05,33.5 39.05,28.1 36.92,25.98 30.13,25.98 28.33,24.18 I2C.4
TOUCH1  (via drill 0.5)
  Top 0.305: v56.42,40.77 56.42,39.47 44.61,27.66 38.84,27.66 37.34,28.99 33.02,28.99 23.65,38.36 23.65,46.46 21.11,49 v21.11,54.9 | v17.46,63.51 17.46,64.46 22.22,69.22 22.22,73.98 T1.P$2
  Bottom 0.305: U1.24 52.32,36.68 v56.42,40.77 | v21.11,54.9 21.11,56.68 17.46,60.33 v17.46,63.51
TOUCH2  (via drill 0.5)
  Top 0.305: v45.62,23.98 35.88,23.98 27.4,15.5 v27.15,15.5 | v24.32,13.82 22.29,11.78 22.29,11.72 22.23,11.66 T2.P$2
  Bottom 0.305: v45.62,23.98 50.7,23.98 52.23,25.5 52.23,27.56 48.1,31.69 48.1,33.5 U1.26 | v27.15,15.5 26,15.5 v24.32,13.82
TXD  (via drill 0.5)
  Top 0.305: v53.05,31.09 52.93,30.96 52.93,24.61 58.17,19.37 v62.07,19.37 | v63.98,17.47 64.93,17.47 65.56,18.1 78.99,18.1 80.77,17.12 81.91,16.48 83.33,16.93 86.25,21.93 86.11,22.45 85.85,23.34 84.71,24.03 84.71,25.42 PROGRAMMER.8
  Bottom 0.305: v53.05,31.09 53.05,32.99 50.2,35.85 39.18,35.85 37.94,34.61 37.94,33.66 U1.34 | v63.98,17.47 v62.07,19.37
VCC  (via drill 0.5)
  Top 0.305: v84.3,33.66 84.3,45.92 80.49,49.73 80.52,63.04 82.71,64.33 SW1.A | v60.58,47.79 60.58,47.22 63.18,44.61 v67.63,44.61 | v56.2,61.44 54.93,62.71 v50.23,62.71
  Bottom 0.305: v84.3,33.66 83.76,33.66 80.74,30.64 80.74,21.94 PROGRAMMER.4 | 68.42,52.34 67.63,53.4 L1.1 66.9,53.82 60.87,47.79 v60.58,47.79 58.36,47.79 56.2,49.95 v56.2,61.44 | R2.2 48.2,63.98 49.47,62.71 v50.23,62.71
  Bottom 0.635: U3.1 v67.62,44.61 v67.63,44.61 | 67.75,44.61 v67.63,44.61 | v67.63,44.61 | 71.44,46.71 76.2,46.71 79.12,49.63 79.12,61.38 80.01,62.71 SW1.A | C1.1 71.44,46.71 | U3.3 67.12,42.71 67.62,43.21 v67.63,44.61 | C3.1 68.58,57.95 68.58,52.46 68.42,52.34 68.2,52.17 | v67.63,44.61 69.72,46.71 71.44,46.71
(copper drawn outside any net)
  shapes: Top circle x4

### Text on the board
tPlace: M1 GND C1 C2 VCC M2 | D0 GND 3V3 | ON | +5V GND | - | RESET | + | OFF | SDA SCL GND +3V3 | GND | GND | SWARMESH 2020 / 2020/07/11 / v1.0.3 | DTR | RTS | M1 GND C1 C2 VCC M2 | +3V3 GND D0
bPlace: POWER | - | +
tNames: IR2